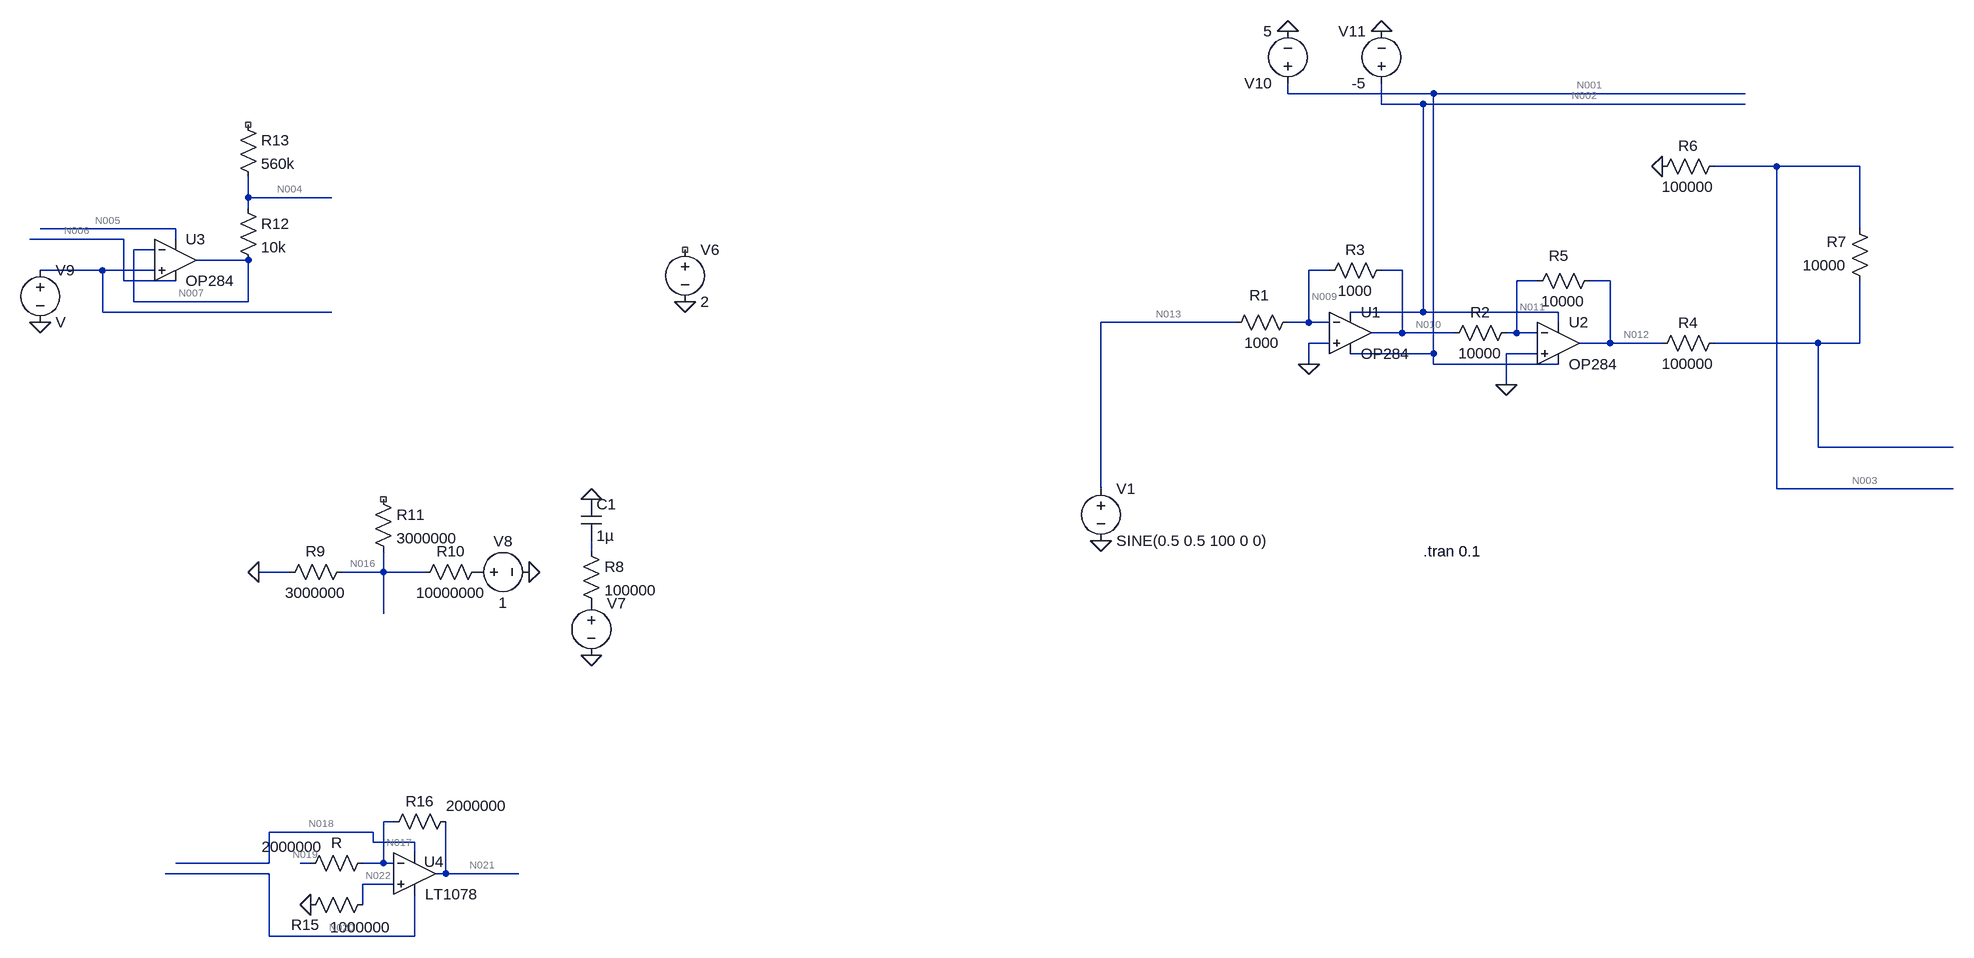
[diagram p0: schematic Sim_analog_GNDed_9_21_20.asc]
Sim_analog_GNDed_9_21_20.asc, the LTspice schematic file:
Version 4
SHEET 1 2288 996
WIRE 400 -304 400 -320
WIRE 624 -304 400 -304
WIRE 1104 -304 624 -304
WIRE 544 -288 544 -320
WIRE 608 -288 544 -288
WIRE 1104 -288 608 -288
WIRE 1152 -192 1056 -192
WIRE 1280 -192 1152 -192
WIRE -1200 -144 -1200 -176
WIRE -1072 -144 -1200 -144
WIRE -1200 -128 -1200 -144
WIRE -1312 -96 -1520 -96
WIRE 1280 -96 1280 -192
WIRE -1392 -80 -1536 -80
WIRE -1312 -80 -1312 -96
WIRE -1344 -64 -1376 -64
WIRE -1200 -48 -1280 -48
WIRE -1424 -32 -1520 -32
WIRE -1344 -32 -1424 -32
WIRE 464 -32 432 -32
WIRE 576 -32 544 -32
WIRE -1392 -16 -1392 -80
WIRE -1312 -16 -1392 -16
WIRE 784 -16 752 -16
WIRE 896 -16 864 -16
WIRE -1376 16 -1376 -64
WIRE -1200 16 -1200 -48
WIRE -1200 16 -1376 16
WIRE -1424 32 -1424 -32
WIRE -1072 32 -1424 32
WIRE 608 32 608 -288
WIRE 608 32 496 32
WIRE 816 32 608 32
WIRE 320 48 112 48
WIRE 432 48 432 -32
WIRE 432 48 400 48
WIRE 464 48 432 48
WIRE 816 48 816 32
WIRE 576 64 576 -32
WIRE 576 64 528 64
WIRE 656 64 576 64
WIRE 752 64 752 -16
WIRE 752 64 736 64
WIRE 784 64 752 64
WIRE 464 80 432 80
WIRE 896 80 896 -16
WIRE 896 80 848 80
WIRE 976 80 896 80
WIRE 1216 80 1056 80
WIRE 1280 80 1280 -16
WIRE 1280 80 1216 80
WIRE 624 96 624 -304
WIRE 624 96 496 96
WIRE 784 96 736 96
WIRE 432 112 432 80
WIRE 624 112 624 96
WIRE 816 112 624 112
WIRE 736 144 736 96
WIRE 1216 240 1216 80
WIRE 1424 240 1216 240
WIRE 112 304 112 48
WIRE 1152 304 1152 -192
WIRE 1424 304 1152 304
WIRE -672 400 -672 384
WIRE -1136 432 -1184 432
WIRE -992 432 -992 400
WIRE -992 432 -1056 432
WIRE -928 432 -992 432
WIRE -992 496 -992 432
WIRE -976 816 -992 816
WIRE -1008 832 -1168 832
WIRE -1008 848 -1008 832
WIRE -944 848 -1008 848
WIRE -944 864 -944 848
WIRE -1168 880 -1168 832
WIRE -1168 880 -1312 880
WIRE -1104 880 -1120 880
WIRE -992 880 -992 816
WIRE -992 880 -1024 880
WIRE -976 880 -992 880
WIRE -1168 896 -1328 896
WIRE -896 896 -896 816
WIRE -896 896 -912 896
WIRE -784 896 -896 896
WIRE -976 912 -1024 912
WIRE -1024 944 -1024 912
WIRE -1168 992 -1168 896
WIRE -944 992 -944 928
WIRE -944 992 -1168 992
FLAG 432 112 0
FLAG 736 144 0
FLAG 112 384 0
FLAG -528 16 0
FLAG -672 560 0
FLAG -672 320 0
FLAG -768 432 0
FLAG -1184 432 0
FLAG -1520 48 0
FLAG -1104 944 0
FLAG 976 -192 0
FLAG 400 -400 0
FLAG 544 -400 0
SYMBOL voltage 112 288 R0
WINDOW 123 0 0 Left 0
WINDOW 39 0 0 Left 0
SYMATTR InstName V1
SYMATTR Value SINE(0.5 0.5 100 0 0)
SYMBOL res 416 32 R90
WINDOW 0 -10 60 VBottom 2
WINDOW 3 32 56 VTop 2
SYMATTR InstName R1
SYMATTR Value 1000
SYMBOL Opamps\\OP284 496 0 R0
SYMATTR InstName U1
SYMBOL res 752 48 R90
WINDOW 0 0 56 VBottom 2
WINDOW 3 32 56 VTop 2
SYMATTR InstName R2
SYMATTR Value 10000
SYMBOL res 560 -48 R90
WINDOW 0 0 56 VBottom 2
WINDOW 3 32 56 VTop 2
SYMATTR InstName R3
SYMATTR Value 1000
SYMBOL res 880 -32 R90
WINDOW 0 -7 63 VBottom 2
WINDOW 3 32 56 VTop 2
SYMATTR InstName R5
SYMATTR Value 10000
SYMBOL res 1072 -208 R90
WINDOW 0 0 56 VBottom 2
WINDOW 3 32 56 VTop 2
SYMATTR InstName R6
SYMATTR Value 100000
SYMBOL res 1296 0 R180
WINDOW 0 36 76 Left 2
WINDOW 3 36 40 Left 2
SYMATTR InstName R7
SYMATTR Value 10000
SYMBOL res 1072 64 R90
WINDOW 0 0 56 VBottom 2
WINDOW 3 32 56 VTop 2
SYMATTR InstName R4
SYMATTR Value 100000
SYMBOL voltage -528 -80 R0
WINDOW 123 0 0 Left 0
WINDOW 39 0 0 Left 0
SYMATTR InstName V6
SYMATTR Value 2
SYMBOL voltage -672 464 R0
WINDOW 123 0 0 Left 0
WINDOW 39 0 0 Left 0
SYMATTR InstName V7
SYMATTR Value ""
SYMBOL res -688 384 R0
SYMATTR InstName R8
SYMATTR Value 100000
SYMBOL cap -688 320 R0
SYMATTR InstName C1
SYMATTR Value 1µ
SYMBOL res -1040 416 R90
WINDOW 0 0 56 VBottom 2
WINDOW 3 32 56 VTop 2
SYMATTR InstName R9
SYMATTR Value 3000000
SYMBOL res -832 416 R90
WINDOW 0 0 56 VBottom 2
WINDOW 3 32 56 VTop 2
SYMATTR InstName R10
SYMATTR Value 10000000
SYMBOL voltage -864 432 R270
WINDOW 0 32 56 VTop 2
WINDOW 3 -32 56 VBottom 2
WINDOW 123 0 0 Left 0
WINDOW 39 0 0 Left 0
SYMATTR InstName V8
SYMATTR Value 1
SYMBOL res -1008 304 R0
SYMATTR InstName R11
SYMATTR Value 3000000
SYMBOL voltage -1520 -48 R0
SYMATTR InstName V9
SYMBOL Opamps\\OP284 -1312 -112 R0
SYMATTR InstName U3
SYMBOL res -1216 -144 R0
SYMATTR InstName R12
SYMATTR Value 10k
SYMBOL res -1216 -272 R0
SYMATTR InstName R13
SYMATTR Value 560k
SYMBOL Opamps\\LT1078 -944 832 R0
WINDOW 0 15 46 Left 2
SYMATTR InstName U4
SYMBOL res -1008 864 R90
WINDOW 0 0 56 VBottom 2
WINDOW 3 -25 124 VTop 2
SYMATTR InstName R
SYMATTR Value 2000000
SYMBOL res -1008 928 R90
WINDOW 0 62 104 VBottom 2
WINDOW 3 35 19 VTop 2
SYMATTR InstName R15
SYMATTR Value 1000000
SYMBOL res -880 800 R90
WINDOW 0 0 56 VBottom 2
WINDOW 3 -24 -32 VTop 2
SYMATTR InstName R16
SYMATTR Value 2000000
SYMBOL voltage 400 -304 R180
WINDOW 123 0 0 Left 0
WINDOW 39 0 0 Left 0
SYMATTR InstName V10
SYMATTR Value 5
SYMBOL voltage 544 -304 R180
WINDOW 0 24 96 Left 2
WINDOW 3 24 16 Left 2
WINDOW 123 0 0 Left 0
WINDOW 39 0 0 Left 0
SYMATTR InstName V11
SYMATTR Value -5
SYMBOL Opamps\\OP284 816 16 R0
SYMATTR InstName U2
TEXT 608 400 Left 2 !.tran 0.1

The netlist it stands for:
* Sim_analog_GNDed_9_21_20.asc
V1 N013 0 SINE(0.5 0.5 100 0 0)
R1 N009 N013 1000
XU1 0 N009 N002 N001 N010 OP284  ; pins In+ In- V+ V- OUT
R2 N011 N010 10000
R3 N010 N009 1000
R5 N012 N011 10000
R6 N003 0 100000
R7 N014 N003 10000
R4 N014 N012 100000
V6 NC_01 0 2
V7 P001 0
R8 N015 P001 100000
C1 0 N015 1µ
R9 N016 0 3000000
R10 P002 N016 10000000
V8 P002 0 1
R11 NC_02 N016 3000000
V9 N008 0 V
XU3 N008 N007 N005 N006 N007 OP284  ; pins In+ In- V+ V- OUT
R12 N004 N007 10k
R13 NC_03 N004 560k
XU4 N022 N017 N018 N020 N021 LT1078  ; pins In+ In- V+ V- OUT
R N017 N019 2000000
R15 N022 0 1000000
R16 N021 N017 2000000
V10 N001 0 5
V11 N002 0 -5
XU2 0 N011 N002 N001 N012 OP284  ; pins In+ In- V+ V- OUT
.tran 0.1
.lib ADI1.lib
.backanno
.end

* Results of the author's LTspice run, read from the files saved beside the schematic
* Operating Point, zero values left out:
*   V(n013) = 500 mV
*   V(n009) = 26.04 mV
*   V(n002) = -5 V
*   V(n001) = 5 V
*   V(n011) = 35.8 µV
*   V(n016) = 230.8 mV
*   V(p002) = 1 V
*   V(n007) = -65.28 µV
*   V(n005) = -628.8 mV
*   V(n006) = 628.7 mV
*   V(n004) = -65.28 µV
*   V(n017) = 18.28 V
*   V(n022) = 28.85 mV
*   V(n018) = 18.84 V
*   V(n021) = 18.33 V
*   V(n020) = 18.33 V
*   V(n019) = 18.28 V
*   I(R16) = 21.27 nA
*   I(R15) = 28.85 nA
*   I(R10) = 76.92 nA
*   I(R9) = 76.92 nA
*   I(R5) = -3.58 nA
*   I(R3) = -26.04 µA
*   I(R2) = 3.58 nA
*   I(R1) = -474 µA
*   I(V11) = 7.144 TA
*   I(V10) = -7.144 TA
*   I(V8) = -76.92 nA
*   I(V1) = -474 µA
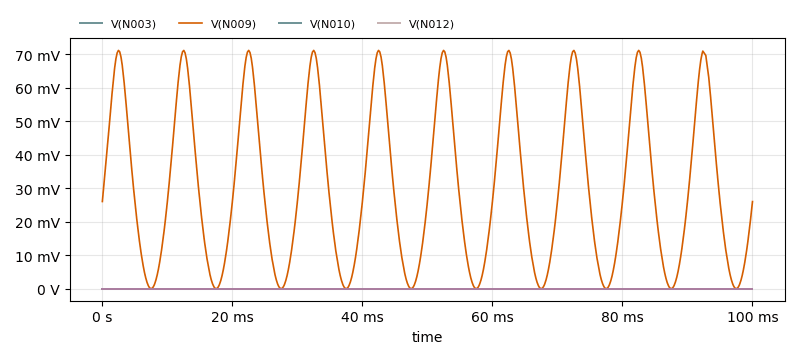
[diagram p1: Transient Analysis of Sim_analog_GNDed_9_21_20.asc, plotted from the saved traces]
* Transient Analysis, 1 run:
*   V(N003): min 6.427 fV, max 7.079 fV, average 6.875 fV, rms 6.875 fV, last 6.898 fV
*   V(N009): min 55.49 µV, max 71.15 mV, average 30.45 mV, rms 38.98 mV, last 26.04 mV
*   V(N010): min 13.4 fV, max 14.91 fV, average 14.65 fV, rms 14.65 fV, last 14.65 fV
*   V(N012): min 13.5 fV, max 14.87 fV, average 14.44 fV, rms 14.44 fV, last 14.49 fV